# Altium schematic sheet MCU.SchDoc
size A4
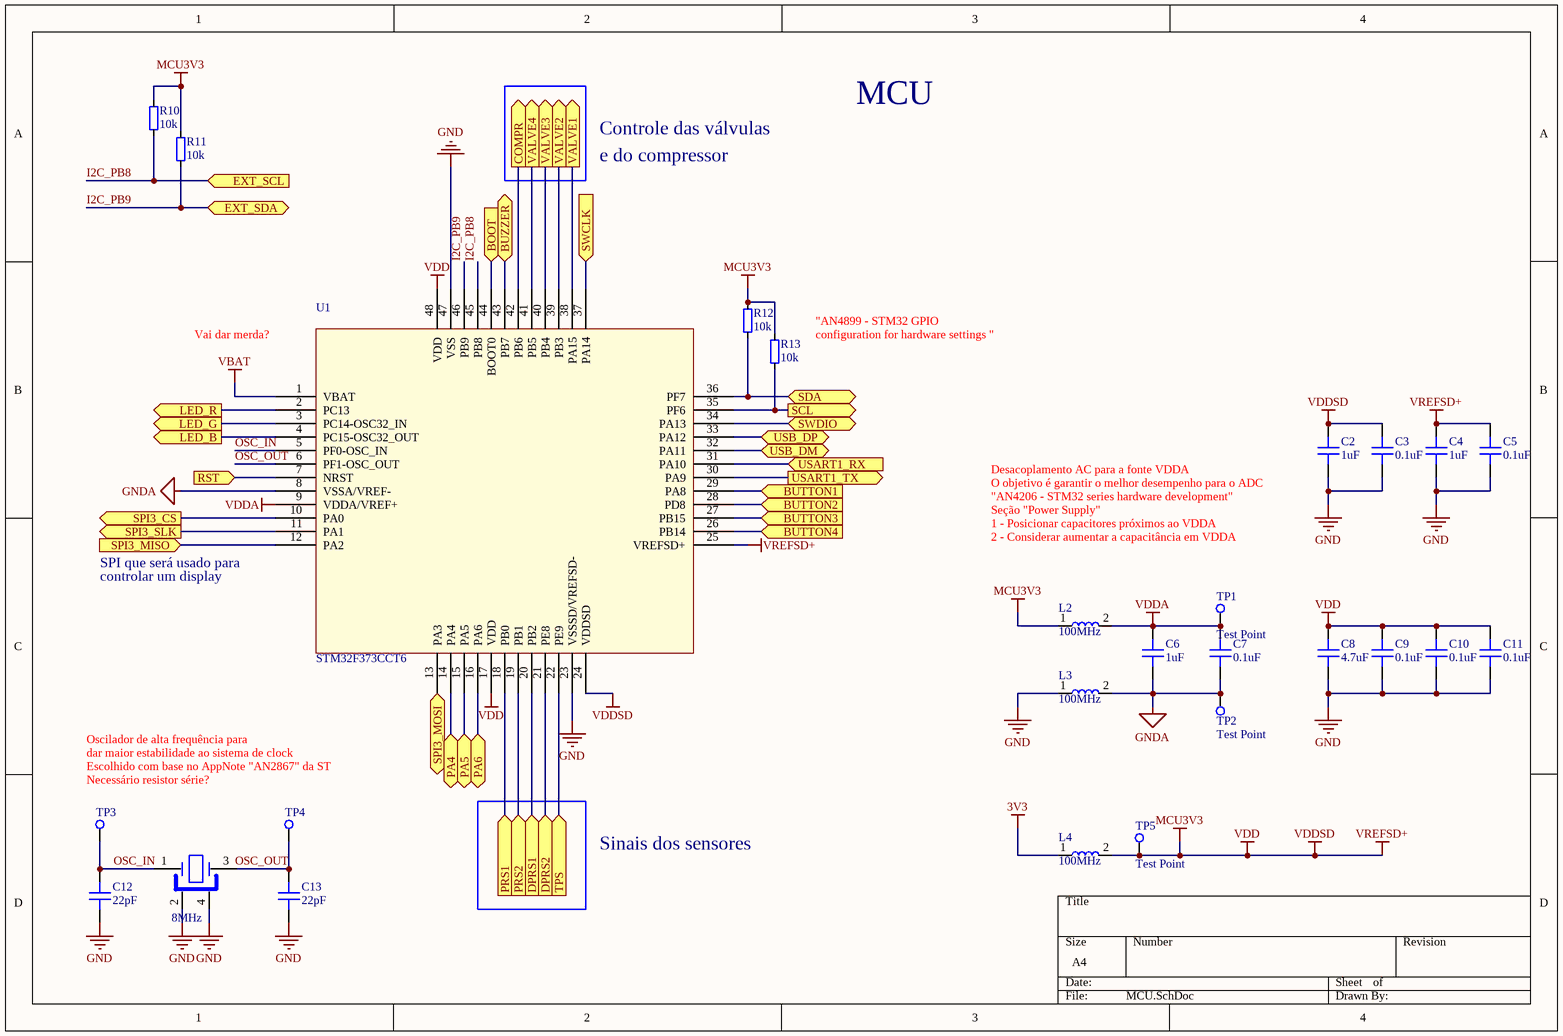
[diagram p0: MCU.SchDoc]

## Parts
C2  1uF  [C_0805]
C3  0.1uF  [C_0805]
C4  1uF  [C_0805]
C5  0.1uF  [C_0805]
C6  1uF  [C_0805]
C7  0.1uF  [C_0805]
C8  4.7uF  [C_0805]
C9  0.1uF  [C_0805]
C10  0.1uF  [C_0805]
C11  0.1uF  [C_0805]
C12  22pF  [C_0603]
C13  22pF  [C_0603]
L2  100MHz  [L_0603]
L3  100MHz  [L_0603]
L4  100MHz  [L_0603]
R10  10k  [R_0805]
R11  10k  [R_0805]
R12  10k  [R_0805]
R13  10k  [R_0805]
TP1  Test Point  [Test_Point]
TP2  Test Point  [Test_Point]
TP3  Test Point  [Test_Point]  (value not drawn)
TP4  Test Point  [Test_Point]  (value not drawn)
TP5  Test Point  [Test_Point]
U1  STM32F373CCT6  [MCU_STM32F373CC7]
XTAL1  8MHz  [XTAL_8MHZ]

## Ports
BOOT (in), BUTTON1 (in), BUTTON2 (in), BUTTON3 (in), BUTTON4 (in), BUZZER, COMPR (out), DPRS1 (in), DPRS2 (in), EXT_SCL (in), EXT_SDA (bidir), LED_B (out), LED_G (out), LED_R (out), PA4 (bidir), PA5 (bidir), PA6 (bidir), PRS1 (in), PRS2 (in), RST (in), SCL (out), SDA (bidir), SPI3_CS (out), SPI3_MISO (in), SPI3_MOSI (out), SPI3_SLK (out), SWCLK (in), SWDIO (bidir), TPS (in), USART1_RX (in), USART1_TX (out), USB_DM, USB_DP, VALVE1 (out), VALVE2 (out), VALVE3 (out), VALVE4 (out)

## Nets
3V3: L4.1
GND: C2.1 C3.2 C4.1 C5.2 C8.2 C9.2 C10.2 C11.2 C12.1 C13.1 L3.1 U1.23(VSSSD/VREFSD-) U1.47(VSS) XTAL1.2 XTAL1.4
GNDA: C6.1 C7.1 L3.2 TP2.1(TP) U1.8(VSSA/VREF-)
MCU3V3: C2.2 C3.1 C4.2 C5.1 C8.1 C9.1 C10.1 C11.1 L2.1 L4.2 R10.2 R11.2 R12.2 R13.2 TP5.1(TP) U1.17(VDD) U1.24(VDDSD) U1.25(VREFSD+) U1.48(VDD)  [also labelled VDD, VDDSD, VREFSD+]
VBAT: U1.1(VBAT)
VDDA: C6.2 C7.2 L2.2 TP1.1(TP) U1.9(VDDA/VREF+)
BOOT: U1.44(BOOT0) ; port BOOT
BUTTON1: U1.29(PA8) ; port BUTTON1
BUTTON2: U1.28(PD8) ; port BUTTON2
BUTTON3: U1.27(PB15) ; port BUTTON3
BUTTON4: U1.26(PB14) ; port BUTTON4
BUZZER: U1.43(PB7) ; port BUZZER
COMPR: U1.42(PB6) ; port COMPR
DPRS1: U1.20(PB2) ; port DPRS1
DPRS2: U1.21(PE8) ; port DPRS2
I2C_PB8: R10.1 U1.45(PB8) ; port EXT_SCL
I2C_PB9: R11.1 U1.46(PB9) ; port EXT_SDA
LED_B: U1.4(PC15-OSC32_OUT) ; port LED_B
LED_G: U1.3(PC14-OSC32_IN) ; port LED_G
LED_R: U1.2(PC13) ; port LED_R
OSC_IN: C12.2 TP3.1(TP) U1.5(PF0-OSC_IN) XTAL1.1
OSC_OUT: U1.6(PF1-OSC_OUT)
PA4: U1.14(PA4) ; port PA4
PA5: U1.15(PA5) ; port PA5
PA6: U1.16(PA6) ; port PA6
PRS1: U1.18(PB0) ; port PRS1
PRS2: U1.19(PB1) ; port PRS2
RST: U1.7(NRST) ; port RST
SCL: R13.1 U1.35(PF6) ; port SCL
SDA: R12.1 U1.36(PF7) ; port SDA
SPI3_CS: U1.10(PA0) ; port SPI3_CS
SPI3_MISO: U1.12(PA2) ; port SPI3_MISO
SPI3_MOSI: U1.13(PA3) ; port SPI3_MOSI
SPI3_SLK: U1.11(PA1) ; port SPI3_SLK
SWCLK: U1.37(PA14) ; port SWCLK
SWDIO: U1.34(PA13) ; port SWDIO
TPS: U1.22(PE9) ; port TPS
USART1_RX: U1.31(PA10) ; port USART1_RX
USART1_TX: U1.30(PA9) ; port USART1_TX
USB_DM: U1.32(PA11) ; port USB_DM
USB_DP: U1.33(PA12) ; port USB_DP
VALVE1: U1.38(PA15) ; port VALVE1
VALVE2: U1.39(PB3) ; port VALVE2
VALVE3: U1.40(PB4) ; port VALVE3
VALVE4: U1.41(PB5) ; port VALVE4
NetC13_2: C13.2 TP4.1(TP) XTAL1.3

## Notes on the sheet
- MCU
- Controle das válvulas
- e do compressor
- (near U1) Vai dar merda?
- (near R13) "AN4899 - STM32 GPIO
- (near R13) configuration for hardware settings "
- Desacoplamento AC para a fonte VDDA
- (near C2) O objetivo é garantir o melhor desempenho para o ADC
- "AN4206 - STM32 series hardware development"
- Seção "Power Supply"
- (near U1) SPI que será usado para
- controlar um display
- 1 - Posicionar capacitores próximos ao VDDA
- 2 - Considerar aumentar a capacitância em VDDA
- Oscilador de alta frequência para
- Escolhido com base no AppNote "AN2867" da ST
- dar maior estabilidade ao sistema de clock
- Necessário resistor série?
- Sinais dos sensores
- Labels drawn without touching a wire or pin: OSC_OUT

## Library data of the parts
C2 C4 C6 = C_0805_UMF212B7105KGHT: SMD/SMT 0805 50V 1uF 10% AEC-Q200 Ceramic; Manufacturer: Taiyo Yuden; Value: 1uF; Voltage: 50V; Datasheet: https://www.mouser.in/datasheet/2/396/taiyo_yuden_07182019_MLCC_AECQ200_Grade_1_X7R_data-1622917.pdf; Supplier: https://www.mouser.in/ProductDetail/Taiyo-Yuden/UMF212B7105KGHT?qs=sGAEpiMZZMukHu%252BjC5l7YbZJogKwR3uAsvk8LFV85oI%3D; Temperature: -55 to 125ºC; Part Number: UMF212B7105KGHT
C3 C5 C7 C9-C11 = C_0805_C0805C104K5RAC7411: SMD/SMT 50V 0.1uF X7R 0805 10% Ceramic; Manufacturer: KEMET; Value: 0.1uF; Voltage: 50V; Datasheet: https://www.mouser.in/datasheet/2/212/KEM_C1002_X7R_SMD-1102033.pdf; Supplier: https://www.mouser.in/ProductDetail/KEMET/C0805C104K5RAC7411?qs=sGAEpiMZZMukHu%252BjC5l7YUy%2FB4dg%2FhTABr7B0xlsxU8%3D; Temperature: -55 to +125ºC; Part Number: C0805C104K5RAC7411
C8 = C_0805_C2012X7R1H475K125AC: SMD/SMT 0805 50VDC 4.7uF 10% X7R CERAMIC; Manufacturer: TDK; Voltage: 50V; Value: 4.7uF; Datasheet: https://www.mouser.in/datasheet/2/400/lcc_commercial_general_en-837201.pdf; Supplier: https://www.mouser.in/ProductDetail/TDK/C2012X7R1H475K125AC?qs=sGAEpiMZZMukHu%252BjC5l7YTxxtVIkCgfDBgHpaxQ5Dmw%3D; Temperature: -55 to 125ºC; Part Number: C2012X7R1H475K125AC
C12 C13 = C_0603_C0603C220J5GACTU: SMD/SMT 50V 22pF 0603 C0G 5%; Manufacturer: KEMET; Value: 22pF; Voltage: 50V; Datasheet: https://www.mouser.in/datasheet/2/212/KEM_C1003_C0G_SMD-1101588.pdf; Supplier: https://www.mouser.in/ProductDetail/?qs=SdEwkH2X7htVYoqIlDdZ9g%3D%3D; Temperature: -55 to +125ºC; Part Number: C0603C220J5GACTU
L2-L4 = L_0603_BKP1608HS271-T: FERRITE BEAD 270 OHM 0603; Value: 100MHz; Datasheet: https://www.mouser.in/datasheet/2/396/mlci08_e-1396622.pdf; Supplier: https://www.mouser.in/ProductDetail/Taiyo-Yuden/BKP1608HS271-T?qs=I6KAKw0tg2zbDi4vUs5b8A==
R10-R13 = R_0805_ERJ-6GEYJ103V: RES 10K OHM 1/8W 5% 0805 SMD; Manufacturer: Panasonic - ECG; Voltage: 150V; Value: 10k; Supplier: https://www.mouser.in/ProductDetail/Panasonic/ERJ-6GEYJ103V?qs=tQNqqtTOejK5rw%252BRxJVxUA==; Datasheet: https://www.mouser.in/datasheet/2/315/AOA0000C301-1488782.pdf; Temperature: -55 to +155ºC; Part Number: ERJ-6GEYJ103V
U1 = MCU_STM32F373CCT6: CORTEX-M4 ST MCU; Part Number: STM32F373CCT6; Datasheet: https://www.mouser.in/datasheet/2/389/dm00046749-1797329.pdf; Supplier: https://www.mouser.in/ProductDetail/STMicroelectronics/STM32F373CCT6?qs=sGAEpiMZZMts0YcPTleK%252BfFyenw%2F%252BoXO
XTAL1 = XTAL_8MHz: ABRACON Crystals 8MHz; Part Number: ABMM2-8.000MHZ-E2-T; Datasheet: https://www.mouser.in/datasheet/2/3/ABMM2-1775066.pdf; Supplier: https://www.mouser.in/ProductDetail/?qs=m%252BUhWDcpCfaGlLHGChx47g%3D%3D; Frequency: 8MHz